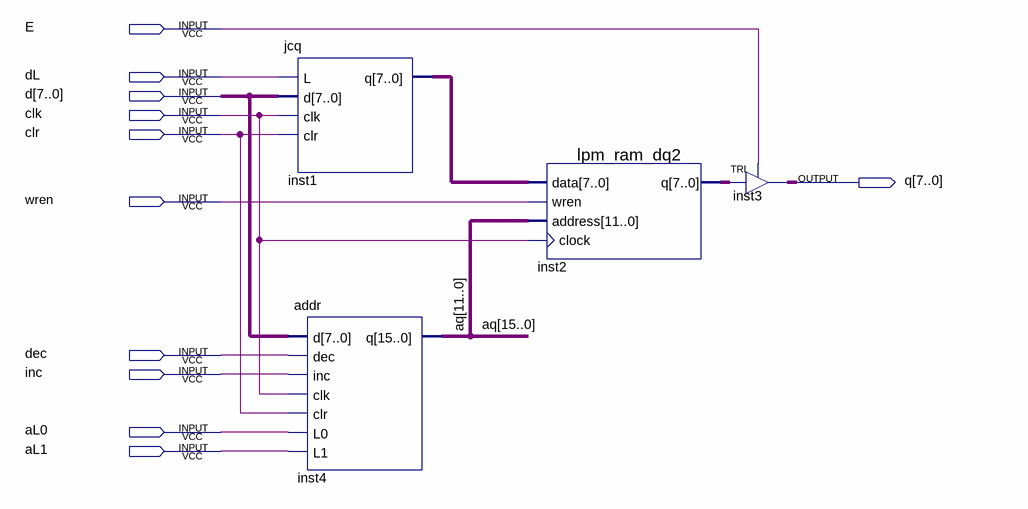
[diagram p0: schematic sheet]
// Quartus schematic ram.bdf as structural Verilog: 4 symbols, 11 pins
module ram (
  input  E,
  input  dL,
  input  [7:0] d,
  input  clk,
  input  clr,
  input  wren,
  input  dec,
  input  inc,
  input  aL0,
  input  aL1,
  output [7:0] q
);

  wire [7:0] inst1_q, inst2_q;
  wire [15:0] aq;

  jcq inst1 (.L(dL), .d(d), .clk(clk), .clr(clr), .q(inst1_q));
  addr inst4 (.d(d), .dec(dec), .inc(inc), .clk(clk), .clr(clr), .L0(aL0), .L1(aL1), .q(aq));
  lpm_ram_dq2 inst2 (.data(inst1_q), .wren(wren), .address(aq[11:0]), .clock(clk), .q(inst2_q));
  TRI inst3[7:0] (.IN(inst2_q), .OE(E), .OUT(q));
endmodule
